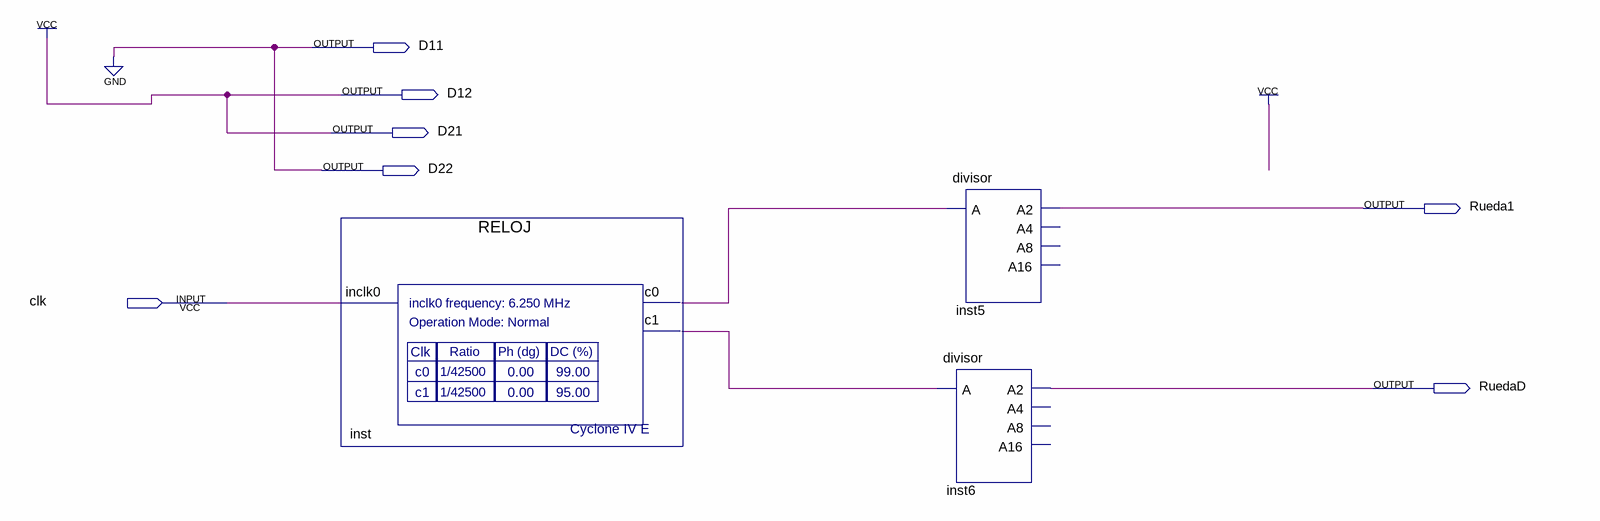
[diagram p0: schematic sheet]
// Quartus schematic ControlPLL.bdf as structural Verilog: 3 symbols, 7 pins
module ControlPLL (
  input  clk,
  output D11,
  output D12,
  output D21,
  output D22,
  output Rueda1,
  output RuedaD
);

  wire inst_c0, inst_c1;

  RELOJ inst (.inclk0(clk), .c0(inst_c0), .c1(inst_c1));
  divisor inst6 (.A(inst_c1), .A2(RuedaD));  // open: A4, A8, A16
  divisor inst5 (.A(inst_c0), .A2(Rueda1));  // open: A4, A8, A16

  assign D11 = 1'b0;
  assign D12 = 1'b1;
  assign D21 = 1'b1;
  assign D22 = 1'b0;
endmodule
